# EAGLE schematic protection (EAGLE 9.6.2)
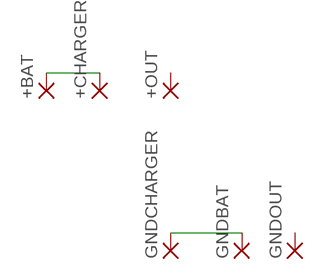
[diagram p0: schematic, sheet 1]

## Parts
+BAT  1,6/0,8  [1,6/0,8]
+CHARGER  1,6/0,8  [1,6/0,8]
+OUT  1,6/0,8  [1,6/0,8]
GNDBAT  1,6/0,8  [1,6/0,8]
GNDCHARGER  1,6/0,8  [1,6/0,8]
GNDOUT  1,6/0,8  [1,6/0,8]

## Nets
N$1: +BAT.1(P) +CHARGER.1(P)
N$2: GNDBAT.1(P) GNDCHARGER.1(P)
Unconnected: +OUT.1(P) GNDOUT.1(P)

## Library data of the parts
+BAT +CHARGER +OUT GNDBAT GNDCHARGER GNDOUT = wirepad:1,6/0,8: THROUGH-HOLE PAD